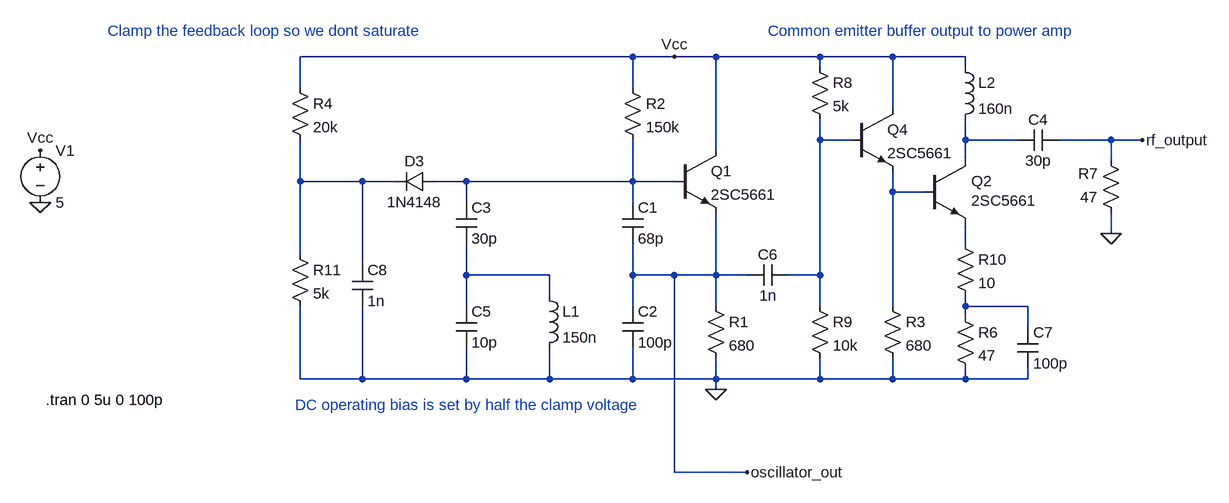
[diagram p0: schematic s9018_100MHz_oscillator.asc]
s9018_100MHz_oscillator.asc, the LTspice schematic file:
Version 4
SHEET 1 1556 680
WIRE 128 -32 -384 -32
WIRE 192 -32 128 -32
WIRE 256 -32 192 -32
WIRE 416 -32 256 -32
WIRE 528 -32 416 -32
WIRE 640 -32 528 -32
WIRE 416 -16 416 -32
WIRE 640 -16 640 -32
WIRE -384 16 -384 -32
WIRE 128 16 128 -32
WIRE 528 48 528 -32
WIRE 416 96 416 64
WIRE 464 96 416 96
WIRE 640 96 640 64
WIRE 720 96 640 96
WIRE 864 96 784 96
WIRE 912 96 864 96
WIRE 256 112 256 -32
WIRE 640 128 640 96
WIRE 864 128 864 96
WIRE -384 160 -384 96
WIRE -288 160 -384 160
WIRE -240 160 -288 160
WIRE -128 160 -176 160
WIRE 128 160 128 96
WIRE 128 160 -128 160
WIRE 192 160 128 160
WIRE 528 176 528 144
WIRE 576 176 528 176
WIRE -128 192 -128 160
WIRE 128 192 128 160
WIRE 864 240 864 208
WIRE 640 256 640 224
WIRE -384 272 -384 160
WIRE -288 288 -288 160
WIRE -128 304 -128 256
WIRE 0 304 -128 304
WIRE 128 304 128 256
WIRE 192 304 128 304
WIRE 256 304 256 208
WIRE 256 304 192 304
WIRE 304 304 256 304
WIRE 416 304 416 96
WIRE 416 304 368 304
WIRE 0 336 0 304
WIRE -128 352 -128 304
WIRE 128 352 128 304
WIRE 256 352 256 304
WIRE 416 352 416 304
WIRE 528 352 528 176
WIRE 640 352 640 336
WIRE 736 352 640 352
WIRE 640 368 640 352
WIRE 736 384 736 352
WIRE -384 464 -384 352
WIRE -288 464 -288 352
WIRE -288 464 -384 464
WIRE -128 464 -128 416
WIRE -128 464 -288 464
WIRE 0 464 0 416
WIRE 0 464 -128 464
WIRE 128 464 128 416
WIRE 128 464 0 464
WIRE 256 464 256 432
WIRE 256 464 128 464
WIRE 416 464 416 432
WIRE 416 464 256 464
WIRE 528 464 528 432
WIRE 528 464 416 464
WIRE 640 464 640 448
WIRE 640 464 528 464
WIRE 736 464 736 448
WIRE 736 464 640 464
WIRE 256 480 256 464
WIRE 192 608 192 304
WIRE 304 608 192 608
FLAG 192 -32 Vcc
FLAG 256 480 0
FLAG -784 112 Vcc
FLAG -784 192 0
FLAG 912 96 rf_output
FLAG 864 240 0
FLAG 304 608 oscillator_out
SYMBOL npn 192 112 R0
SYMATTR InstName Q1
SYMATTR Value 2SC5661
SYMBOL cap 112 192 R0
SYMATTR InstName C1
SYMATTR Value 68p
SYMBOL cap 112 352 R0
SYMATTR InstName C2
SYMATTR Value 100p
SYMBOL res 240 336 R0
SYMATTR InstName R1
SYMATTR Value 680
SYMBOL cap -144 192 R0
SYMATTR InstName C3
SYMATTR Value 30p
SYMBOL ind -16 320 R0
SYMATTR InstName L1
SYMATTR Value 150n
SYMBOL res 112 0 R0
SYMATTR InstName R2
SYMATTR Value 150k
SYMBOL voltage -784 96 R0
WINDOW 123 0 0 Left 0
WINDOW 39 0 0 Left 0
SYMATTR InstName V1
SYMATTR Value 5
SYMBOL diode -176 144 R90
WINDOW 0 0 32 VBottom 2
WINDOW 3 32 32 VTop 2
SYMATTR InstName D3
SYMATTR Value 1N4148
SYMBOL npn 576 128 R0
WINDOW 0 73 31 Left 2
WINDOW 3 73 61 Left 2
SYMATTR InstName Q2
SYMATTR Value 2SC5661
SYMBOL ind 624 -32 R0
SYMATTR InstName L2
SYMATTR Value 160n
SYMBOL cap 784 80 R90
WINDOW 0 0 32 VBottom 2
WINDOW 3 32 32 VTop 2
SYMATTR InstName C4
SYMATTR Value 30p
SYMBOL res 880 224 R180
WINDOW 0 36 76 Left 2
WINDOW 3 36 40 Left 2
SYMATTR InstName R7
SYMATTR Value 47
SYMBOL res 624 352 R0
SYMATTR InstName R6
SYMATTR Value 47
SYMBOL res 400 -32 R0
SYMATTR InstName R8
SYMATTR Value 5k
SYMBOL res 400 336 R0
SYMATTR InstName R9
SYMATTR Value 10k
SYMBOL cap 368 288 R90
WINDOW 0 0 32 VBottom 2
WINDOW 3 32 32 VTop 2
SYMATTR InstName C6
SYMATTR Value 1n
SYMBOL cap 720 384 R0
SYMATTR InstName C7
SYMATTR Value 100p
SYMBOL res 624 240 R0
SYMATTR InstName R10
SYMATTR Value 10
SYMBOL npn 464 48 R0
SYMATTR InstName Q4
SYMATTR Value 2SC5661
SYMBOL res 512 336 R0
SYMATTR InstName R3
SYMATTR Value 680
SYMBOL cap -144 352 R0
SYMATTR InstName C5
SYMATTR Value 10p
SYMBOL cap -304 288 R0
SYMATTR InstName C8
SYMATTR Value 1n
SYMBOL res -400 0 R0
SYMATTR InstName R4
SYMATTR Value 20k
SYMBOL res -400 256 R0
SYMATTR InstName R11
SYMATTR Value 5k
TEXT -776 496 Left 2 !.tran 0 5u 0 100p
TEXT -680 -72 Left 2 ;Clamp the feedback loop so we dont saturate
TEXT 336 -72 Left 2 ;Common emitter buffer output to power amp
TEXT -392 504 Left 2 ;DC operating bias is set by half the clamp voltage

The netlist it stands for:
* s9018_100MHz_oscillator.asc
Q1 Vcc N004 oscillator_out 0 2SC5661
C1 N004 oscillator_out 68p
C2 oscillator_out 0 100p
R1 oscillator_out 0 680
C3 N004 N007 30p
L1 N007 0 150n
R2 Vcc N004 150k
V1 Vcc 0 5
D3 N004 N003 1N4148
Q2 N002 N005 N006 0 2SC5661
L2 Vcc N002 160n
C4 rf_output N002 30p
R7 0 rf_output 47
R6 N008 0 47
R8 Vcc N001 5k
R9 N001 0 10k
C6 N001 oscillator_out 1n
C7 N008 0 100p
R10 N006 N008 10
Q4 Vcc N001 N005 0 2SC5661
R3 N005 0 680
C5 N007 0 10p
C8 N003 0 1n
R4 Vcc N003 20k
R11 N003 0 5k
.model D D
.lib standard.dio
.model NPN NPN
.model PNP PNP
.lib standard.bjt
.tran 0 5u 0 100p
* Clamp the feedback loop so we dont saturate
* Common emitter buffer output to power amp
* DC operating bias is set by half the clamp voltage
.backanno
.end